# EAGLE design spindle-driver-discrete (EAGLE 7.7.0)

## Sheet 1 of 2
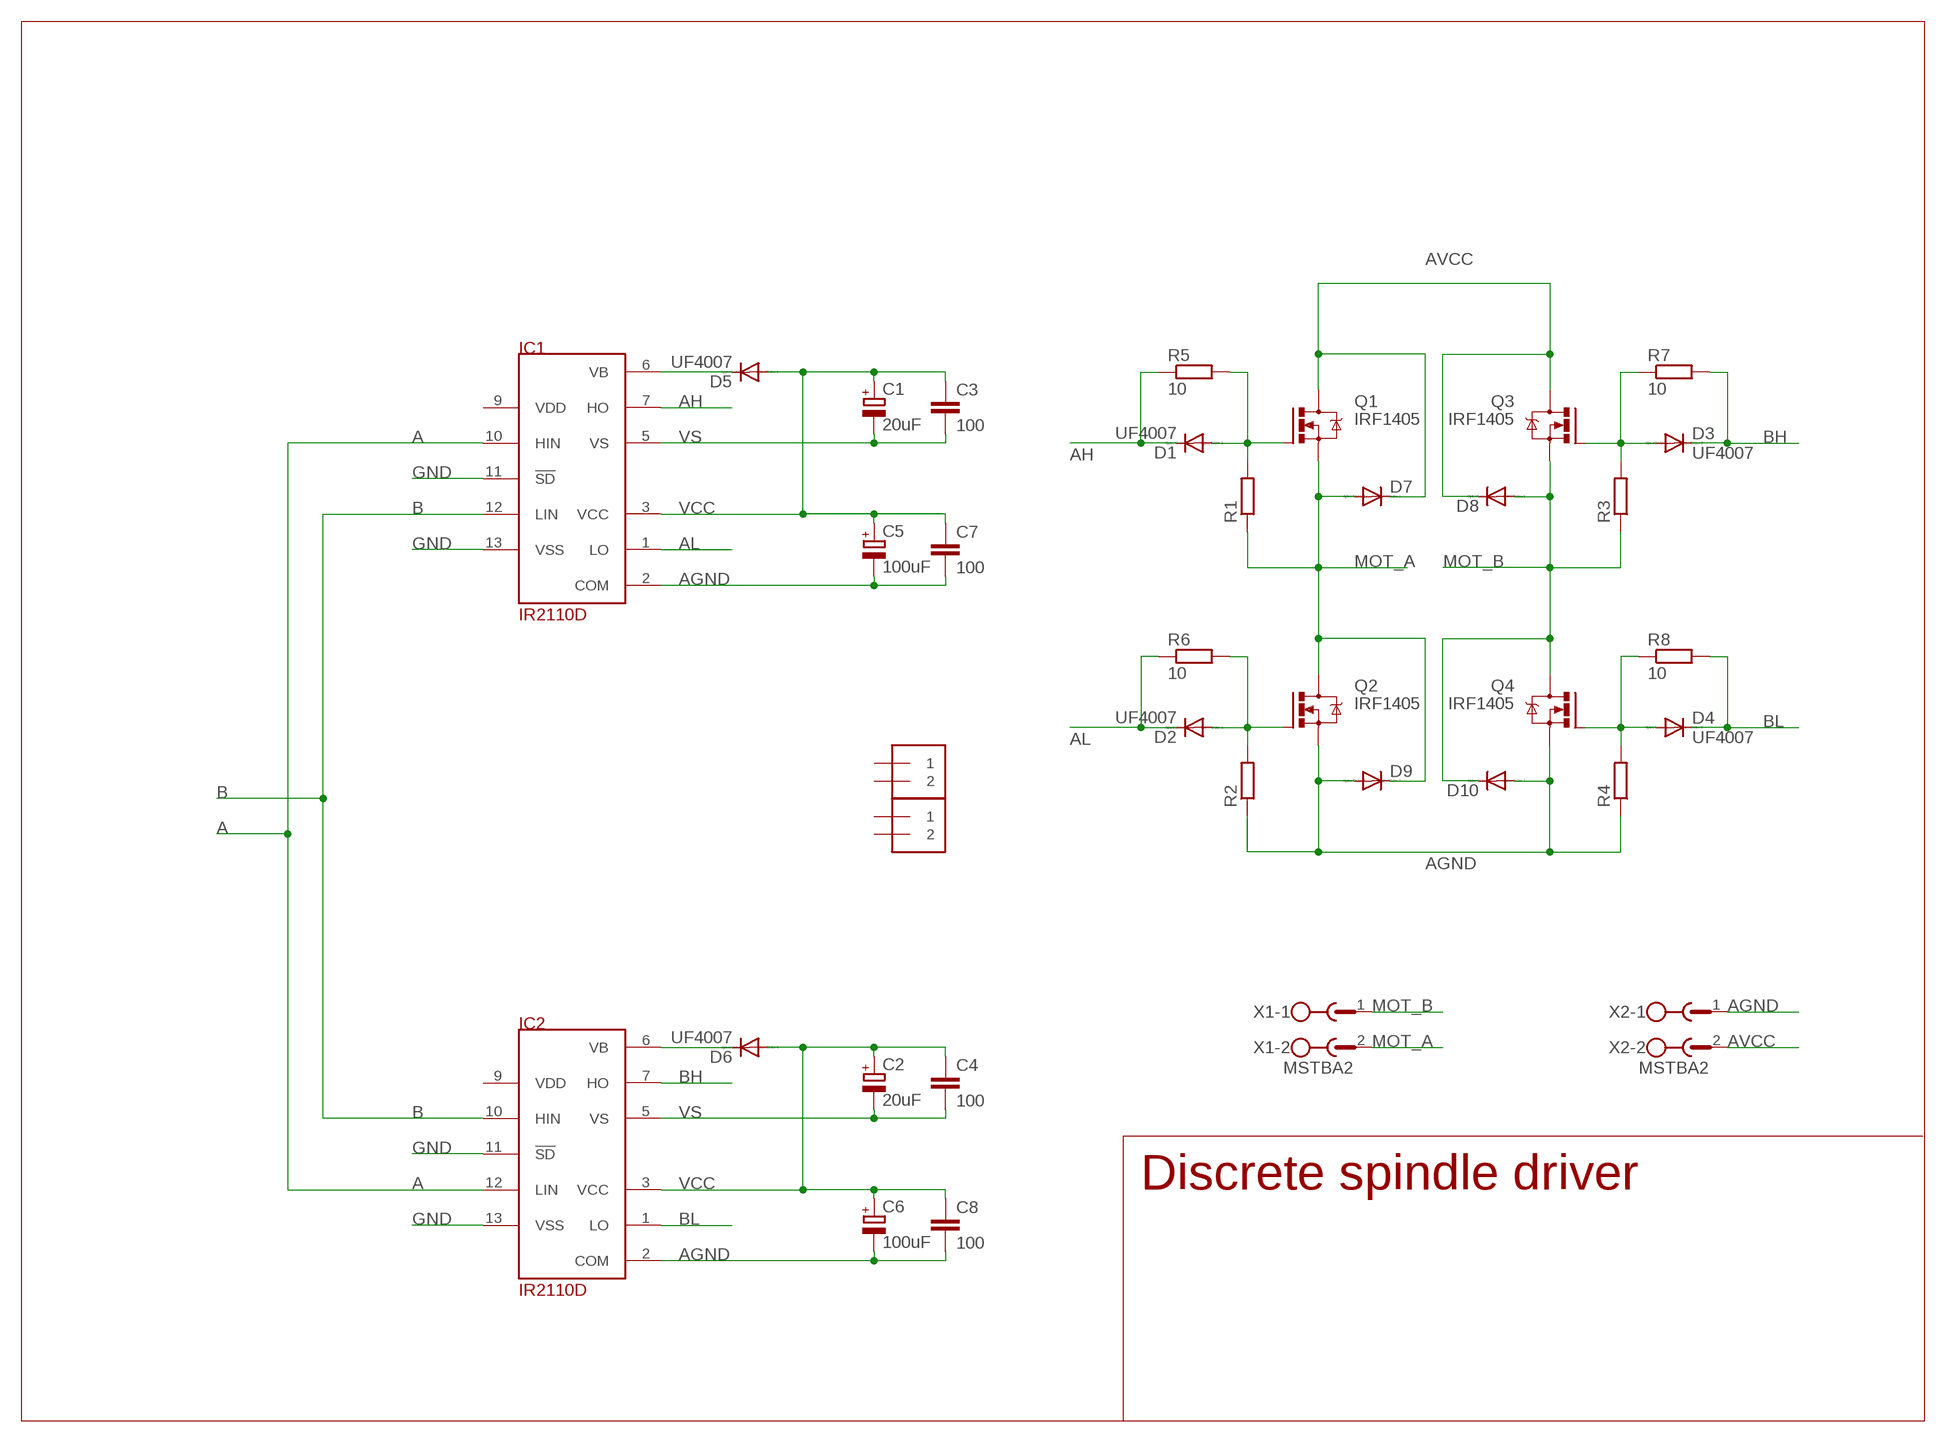
[diagram p0: schematic, sheet 1]

### Parts
C1  20uF  CPOL-EUE2.5-5  [E2,5-5]
C2  20uF  CPOL-EUE2.5-5  [E2,5-5]
C3  100  C-EUC0805  [C0805]
C4  100  C-EUC0805  [C0805]
C5  100uF  CPOL-EUE2.5-5  [E2,5-5]
C6  100uF  CPOL-EUE2.5-5  [E2,5-5]
C7  100  C-EUC0805  [C0805]
C8  100  C-EUC0805  [C0805]
D1  UF4007  UF4003  [DO41-10]
D2  UF4007  UF4003  [DO41-10]
D3  UF4007  UF4003  [DO41-10]
D4  UF4007  UF4003  [DO41-10]
D5  UF4007  UF4003  [DO41-10]
D6  UF4007  UF4003  [DO41-10]
D7  DIODE-DO27-15  [DO27-15]
D8  DIODE-DO27-15  [DO27-15]
D9  DIODE-DO27-15  [DO27-15]
D10  DIODE-DO27-15  [DO27-15]
IC1  IR2110D  [DIL14]
IC2  IR2110D  [DIL14]
J1  1X2-3.5MM  [1X2-3.5MM]
J2  1X2-3.5MM  [1X2-3.5MM]
Q1  IRF1405  IRF540  [TO220BV]
Q2  IRF1405  IRF540  [TO220BV]
Q3  IRF1405  IRF540  [TO220BV]
Q4  IRF1405  IRF540  [TO220BV]
R1  R-EU_0207/10  [0207/10]
R2  R-EU_0207/10  [0207/10]
R3  R-EU_0207/10  [0207/10]
R4  R-EU_0207/10  [0207/10]
R5  10  R-EU_0207/10  [0207/10]
R6  10  R-EU_0207/10  [0207/10]
R7  10  R-EU_0207/10  [0207/10]
R8  10  R-EU_0207/10  [0207/10]
X1  MSTBA2  [MSTBA2]
X2  MSTBA2  [MSTBA2]

### Nets
A: IC1.10(HIN) IC2.12(LIN) ; also sheet 2
AGND: C5.- C6.- C7.2 C8.2 D9.A D10.A IC1.2(COM) IC2.2(COM) Q2.S Q4.S R2.1 R4.1 X2.1
AH: D1.C IC1.7(HO) R5.1
AL: D2.C IC1.1(LO) R6.1
AVCC: D7.C D8.C Q1.D Q3.D X2.2
B: IC1.12(LIN) IC2.10(HIN) ; also sheet 2
BH: D3.C IC2.7(HO) R7.2
BL: D4.C IC2.1(LO) R8.2
GND: IC1.11(!SD) IC1.13(VSS) IC2.11(!SD) IC2.13(VSS) ; also sheet 2
MOT_A: D7.A D9.C Q1.S Q2.D R1.1 X1.2
MOT_B: D8.A D10.C Q3.S Q4.D R3.1 X1.1
N$3: D2.A Q2.G R2.2 R6.2
N$4: D1.A Q1.G R1.2 R5.2
N$5: D4.A Q4.G R4.2 R8.1
N$6: D3.A Q3.G R3.2 R7.1
VB: D5.C D6.C IC1.6(VB) IC2.6(VB)
VCC: C1.+ C2.+ C3.1 C4.1 C5.+ C6.+ C7.1 C8.1 D5.A D6.A IC1.3(VCC) IC2.3(VCC)
VS: C1.- C2.- C3.2 C4.2 IC1.5(VS) IC2.5(VS)
Unconnected: IC1.9(VDD) IC2.9(VDD) J1.1 J1.2 J2.1 J2.2

### Notes on the sheet
- Discrete spindle driver

## Sheet 2 of 2
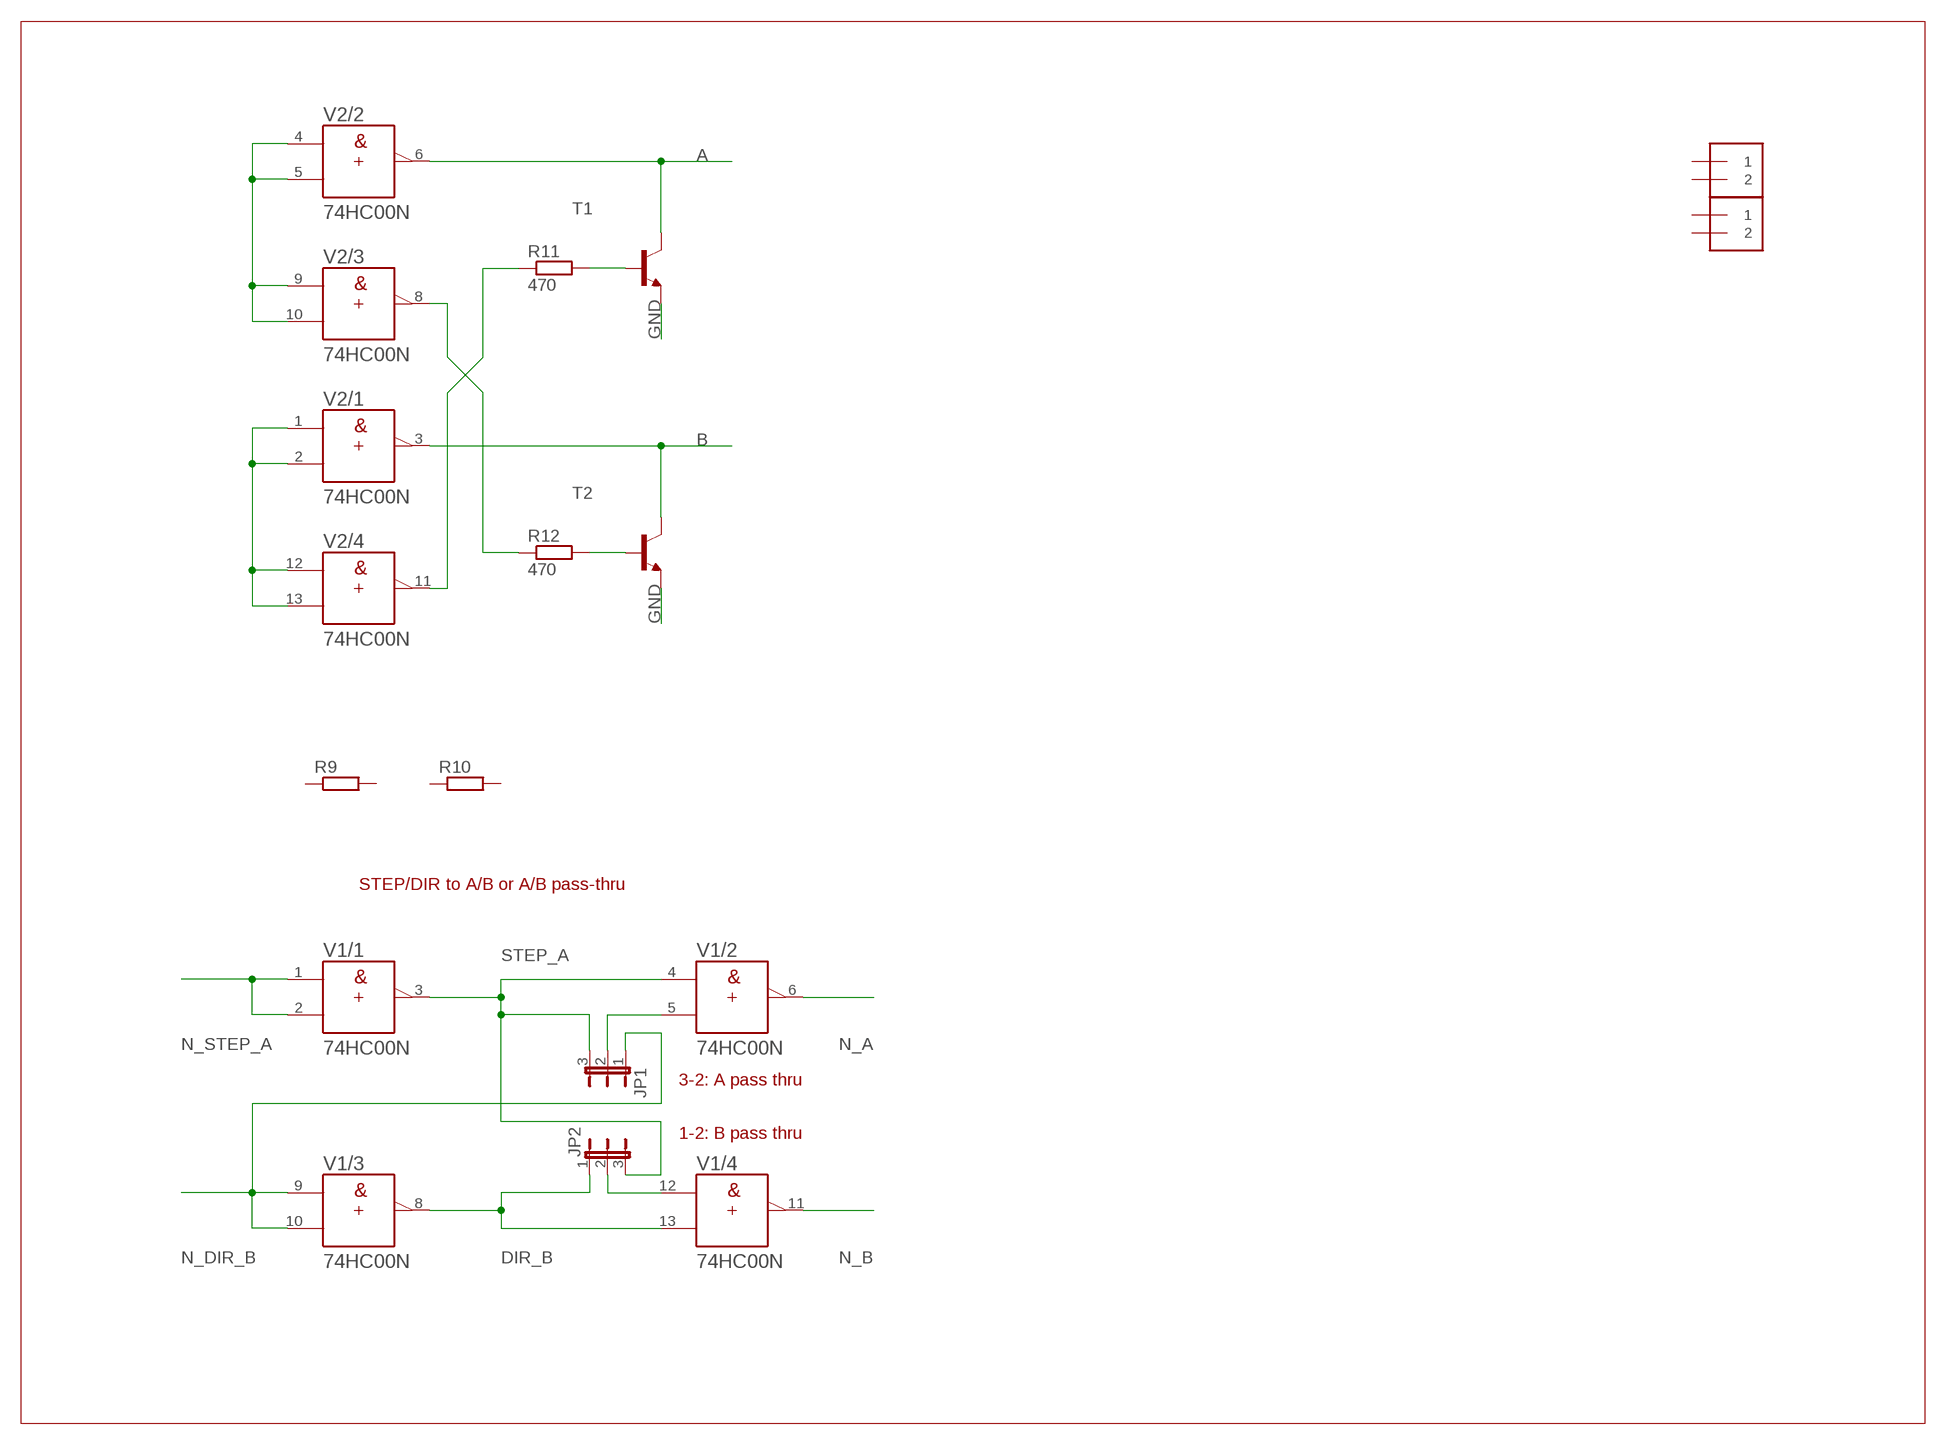
[diagram p1: schematic, sheet 2]

### Parts
J3  1X2-3.5MM  [1X2-3.5MM]
J4  1X2-3.5MM  [1X2-3.5MM]
JP1  JP2E  [JP2]
JP2  JP2E  [JP2]
R9  R-EU_0207/10  [0207/10]
R10  R-EU_0207/10  [0207/10]
R11  470  R-EU_0207/10  [0207/10]
R12  470  R-EU_0207/10  [0207/10]
T1  BC547-NPN-TO92-CBE  [TO92-CBE]
T2  BC547-NPN-TO92-CBE  [TO92-CBE]
V1  74HC00N  [DIL14]
V2  74HC00N  [DIL14]

### Nets
A: T1.C V2.6(/2:Y) ; also sheet 1
B: T2.C V2.3(/1:Y) ; also sheet 1
DIR_B: JP2.1 V1.8(/3:Y) V1.13(/4:B)
GND: T1.E T2.E ; also sheet 1
N$1: JP1.2 V1.5(/2:B)
N$2: JP2.2 V1.12(/4:A)
N$7: V2.4(/2:A) V2.5(/2:B) V2.9(/3:A) V2.10(/3:B)
N$8: V2.1(/1:A) V2.2(/1:B) V2.12(/4:A) V2.13(/4:B)
N$9: R12.1 V2.8(/3:Y)
N$10: R11.1 V2.11(/4:Y)
N$11: R11.2 T1.B
N$12: R12.2 T2.B
N_A: V1.6(/2:Y)
N_B: V1.11(/4:Y)
N_DIR_B: JP1.1 V1.9(/3:A) V1.10(/3:B)
N_STEP_A: V1.1(/1:A) V1.2(/1:B)
STEP_A: JP1.3 JP2.3 V1.3(/1:Y) V1.4(/2:A)
Unconnected: J3.1 J3.2 J4.1 J4.2 R9.1 R9.2 R10.1 R10.2

### Notes on the sheet
- STEP/DIR to A/B or A/B pass-thru
- 3-2: A pass thru
- 1-2: B pass thru

## Power pins joined to a net without a drawn wire
+UB: V1.14(/+UB:+UB) V2.14(/+UB:+UB)
-UB: V1.7(/-UB:-UB) V2.7(/-UB:-UB)

## Library data of the parts
C1 C2 C5 C6 = rcl:CPOL-EU: POLARIZED CAPACITOR, European symbol
C3 C4 C7 C8 = rcl:C-EU: CAPACITOR, European symbol
D1-D6 = diode:UF4003: DIODE ultrafast recovery diode, 200 V rectifier
D7-D10 = diode:DIODE-: DIODE
IC1 IC2 = irs:IR2110
J1-J4 = adafruit:1X2: 3.5mm Terminal block http://www.ladyada.net/library/pcb/eaglelibrary.html
JP1 JP2 = jumper:JP2E: JUMPER
Q1-Q4 = transistor-power:IRF540: HEXFET Power MOSFET
R1-R12 = rcl:R-EU_: RESISTOR, European symbol
T1 T2 = transistor:*-NPN-: NPN Transistror BF959 corrected 2008.03.06
V1 V2 = 74ttl-din:74*00: Quad 2-input NAND gate
X1 X2 = con-phoenix-508:MSTBA2: PHOENIX; MF: FARNELL; MPN: 1757242; OC_FARNELL: 3705171; OC_NEWARK: 71C4161

## Board
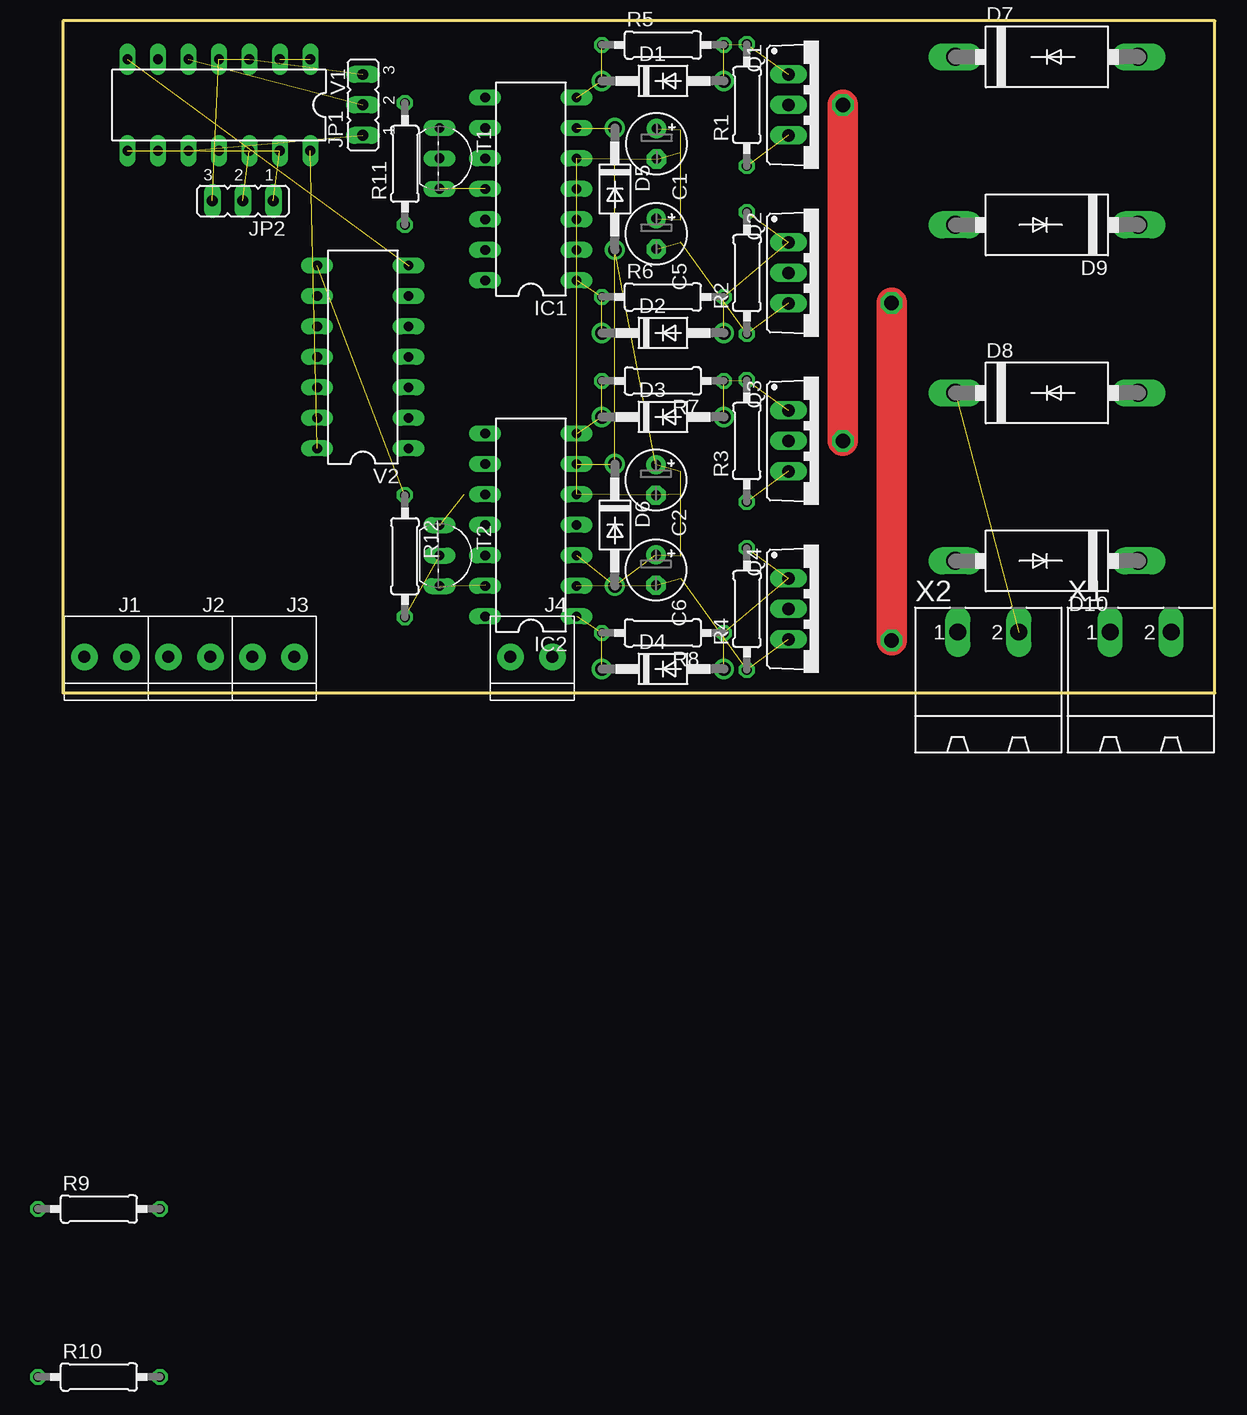
[diagram p2: board, top side]
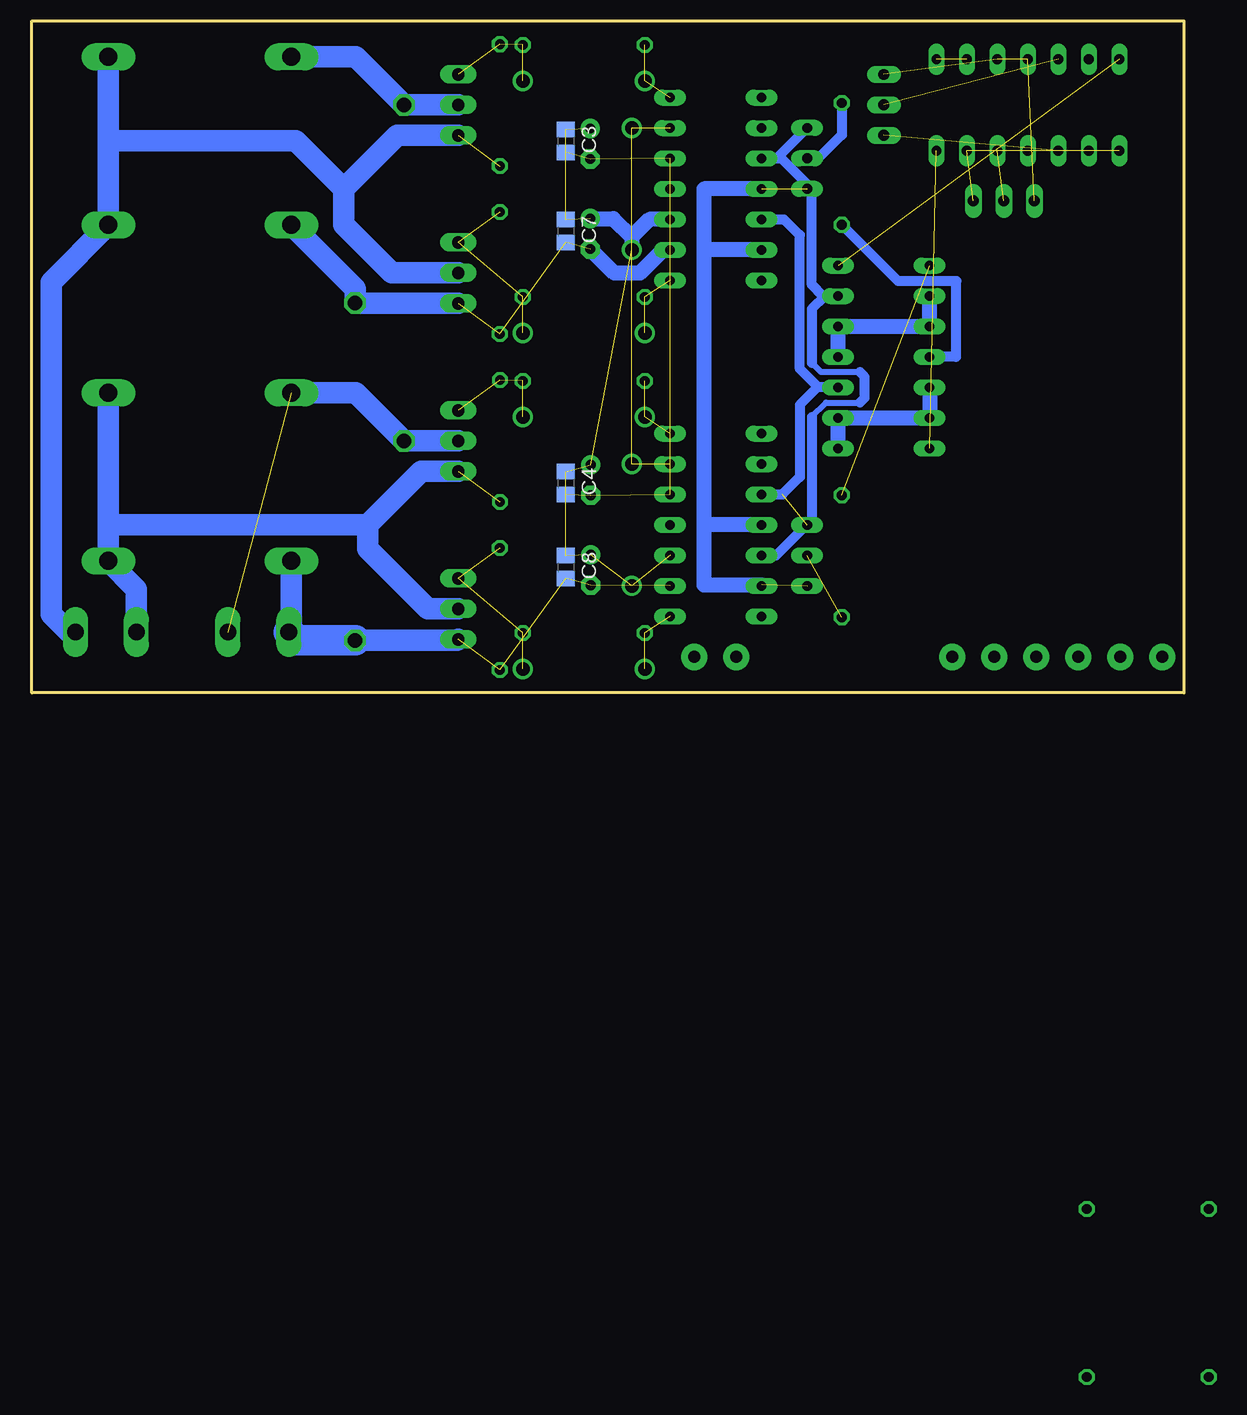
[diagram p3: board, bottom side, seen from below]

No outline drawn. Coordinates in mm, seen from the top.
Copper layers (1*16): Top 0.035mm / dielectric 1.5mm / Bottom 0.035mm
Design rules "default": minimum track width 10mil, minimum drill 24mil, track to track 8mil, track to pad 8mil, pad to pad 8mil, via to via 8mil, smd to smd 8mil, copper to edge 40mil, drill to drill 8mil, minimum pad ring 10mil, minimum via ring 8mil, stop-mask expansion 4mil, vias tented up to drill 0mil, thermal gap 10mil
Milling: 4 lines

### Footprints (pad centres in the part's own frame; a part is rotated, then mirrored left to right if it is on the bottom)
E2,5-5 = drill 0.813 pad 1.6: + -1.27,0 | drill 0.813 pad 1.6 octagon: - 1.27,0
C0805 = smd 1.3 x 1.5: 1 -0.95,0; 2 0.95,0
DO41-10 = drill 1.118: A 5.08,0; C -5.08,0
DO27-15 = drill 1.499 long: A 7.62,0; C -7.62,0
DIL14 = drill 0.813 long: 1 -7.62,-3.81; 2 -5.08,-3.81; 3 -2.54,-3.81; 4 0,-3.81; 5 2.54,-3.81; 6 5.08,-3.81; 7 7.62,-3.81; 8 7.62,3.81; 9 5.08,3.81; 10 2.54,3.81; 11 0,3.81; 12 -2.54,3.81; 13 -5.08,3.81; 14 -7.62,3.81
1X2-3.5MM = drill 1 pad 2.184: 1 1.8,0; 2 -1.7,0
JP2 = drill 0.914 long: 1 -2.54,0; 2 0,0; 3 2.54,0
TO220BV = drill 1.016 long: D 0,-2.54; G -2.54,-2.54; S 2.54,-2.54
0207/10 = drill 0.813 octagon: 1 -5.08,0; 2 5.08,0
TO92-CBE = drill 0.813 long: B 0,0; C -2.54,0; E 2.54,0
MSTBA2 = drill 1.397 long: 1 -2.54,5.08; 2 2.54,5.08

### Placement (x,y rotation side)
C1  49.47,45.76 270 top
C2  49.42,17.75 270 top
C3  51.5,46 270 bottom
C4  51.5,17.5 270 bottom
C5  49.46,38.26 270 top
C6  49.43,10.24 270 top
C7  51.5,38.5 270 bottom
C8  51.5,10.5 270 bottom
D1  50,51 0 top
D2  50,30 0 top
D3  50,23 0 top
D4  50,2 0 top
D5  46,42 270 top
D6  46,14 270 top
D7  82,53 0 top
D8  82,25 0 top
D9  82,39 180 top
D10  82,11 180 top
IC1  39,42 90 top
IC2  39,14 90 top
J1  3.5,3 0 top
J2  10.5,3 0 top
J3  17.5,3 0 top
J4  39,3 0 top
JP1  25,49 90 top
JP2  15,41 180 top
Q1  63,49 270 top
Q2  63,35 270 top
Q3  63,21 270 top
Q4  63,7 270 top
R1  57,48.99 90 top
R2  57,35 90 top
R3  56.99,21 90 top
R4  57,7 90 top
R5  50,54 0 top
R6  50,33 0 top
R7  50,26 180 top
R8  50,5 180 top
R9  3,-43 0 top
R10  3,-57 0 top
R11  28.5,44.09 90 top
R12  28.5,11.4 270 top
T1  31.39,44.55 270 top
T2  31.39,11.45 270 top
V1  13,49 180 top
V2  25,28 90 top
X1  89.82,0 0 top
X2  77.12,0 0 top

### Tracks (layer width: path | path; a pad name or v marks a point on that pad's centre or on a via)
+UB  (1 unrouted)
-UB  (1 unrouted)
A
  Bottom 0.5: 31,27.5 30.25,26.75 27,26.75 | 31,23 29.8,24.2 27,24.2
  Bottom 0.813: V2.6 29.92,33.08 | 29.92,33.08 31,32 31,27.5 | 27,24.2 26.6,24.6 26.6,26.35 27,26.75 | 31,23 31,14.45 34,11.45 IC2.12 | IC1.10 34,44.54 33.94,44.54 | 33.94,44.54 33.54,44.54 31,42 31,34 30.08,33.08 29.92,33.08 | T1.C 33.94,44.54
AGND  (via drill 1.2)  (7 unrouted)
  Top 2.54: v69.06,32.5 v69.06,4.38
  Bottom 1.27: IC1.2 43.4,36.92 45.33,34.99 47.46,34.99 C5.-
  Bottom 1.778: Q2.S 69.02,32.46 v69.06,32.5 69.06,33.68 D9.A | v69.06,4.38 60.55,4.38 Q4.S | D10.A 74.38,5.28 X2.1
  Bottom 2.54: v69.06,4.38 73.88,4.38 X2.1
AH  (2 unrouted)
AL  (2 unrouted)
AVCC  (via drill 1.2)  (1 unrouted)
  Top 2.54: v65,21 v65,49
  Bottom 1.778: Q3.D v65,21 69,25 D8.C | Q1.D v65,49 69,53 D7.C
B  (1 unrouted)
  Bottom 0.813: V2.3 30.54,25.46 | 30.54,25.46 32,24 32,18 33.46,16.54 IC2.10 | 30.54,25.46 30.54,25.54 32,27 32,38.15 33.3,39.45 IC1.12
BH  (2 unrouted)
BL  (2 unrouted)
DIR_B  (2 unrouted)
GND  (2 unrouted)
  Bottom 1.27: IC1.11 40,42 40,36.92 | 40,36.92 40,14 | 40,14 40,9 35.19,9 IC2.13 | IC2.11 40,14 | IC1.13 40,36.92
MOT_A  (1 unrouted)
  Bottom 1.778: Q1.S 65.54,46.46 70,42 | Q2.D 66,35 70,39 70,42 | D7.A 89.62,46 | 89.62,46 D9.C 94.38,34.24 94.38,6.56 92.89,5.08 X1.2 | 70,42 74,46 89.62,46
MOT_B  (1 unrouted)
  Bottom 1.778: Q4.D 63,7 68,12 68,14 | Q3.S 63.54,18.46 68,14 | D8.A 89.62,14 | 89.62,14 D10.C 87.28,8.66 X1.1 | 68,14 89.62,14
N$1  (1 unrouted)
N$2  (1 unrouted)
N$3  (3 unrouted)
N$4  (3 unrouted)
N$5  (3 unrouted)
N$6  (3 unrouted)
N$7
  Bottom 1.27: V2.4 V2.5 V2.10 V2.9
N$8
  Bottom 1.27: V2.1 V2.2 V2.13 V2.12
N$9  (1 unrouted)
N$10
  Bottom 0.813: R11.1 23.84,34.35 18.95,34.35 19,34.3 19,28 V2.11
N$11
  Bottom 0.813: R11.2 28.5,46.5 30.45,44.55 T1.B
N$12  (1 unrouted)
N_DIR_B  (2 unrouted)
N_STEP_A  (1 unrouted)
STEP_A  (3 unrouted)
VB  (3 unrouted)
VCC  (9 unrouted)
  Bottom 1.27: IC1.3 44.54,39.46 46,38 | 46,38 D5.A | C5.+ 47.53,39.53 46,38
VS  (5 unrouted)